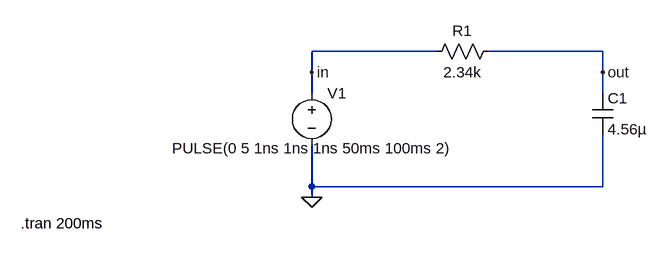
[diagram p0: schematic RC Circuit.asc]
RC Circuit.asc, the LTspice schematic file:
Version 4
SHEET 1 880 680
WIRE 144 80 -48 80
WIRE 400 80 224 80
WIRE -48 112 -48 80
WIRE 400 112 400 80
WIRE -48 144 -48 112
WIRE 400 144 400 112
WIRE -48 288 -48 224
WIRE 400 288 400 208
WIRE 400 288 -48 288
WIRE -48 304 -48 288
FLAG -48 304 0
FLAG 400 112 out
FLAG -48 112 in
SYMBOL res 240 64 R90
WINDOW 0 0 56 VBottom 2
WINDOW 3 32 56 VTop 2
SYMATTR InstName R1
SYMATTR Value 2.34k
SYMBOL cap 384 144 R0
SYMATTR InstName C1
SYMATTR Value 4.56µ
SYMBOL voltage -48 128 R0
WINDOW 3 -215 101 Left 2
WINDOW 123 0 0 Left 0
WINDOW 39 0 0 Left 0
SYMATTR InstName V1
SYMATTR Value PULSE(0 5 1ns 1ns 1ns 50ms 100ms 2)
TEXT -496 344 Left 2 !.tran 200ms

The netlist it stands for:
* RC Circuit.asc
R1 out in 2.34k
C1 out 0 4.56µ
V1 in 0 PULSE(0 5 1ns 1ns 1ns 50ms 100ms 2)
.tran 200ms
.backanno
.end